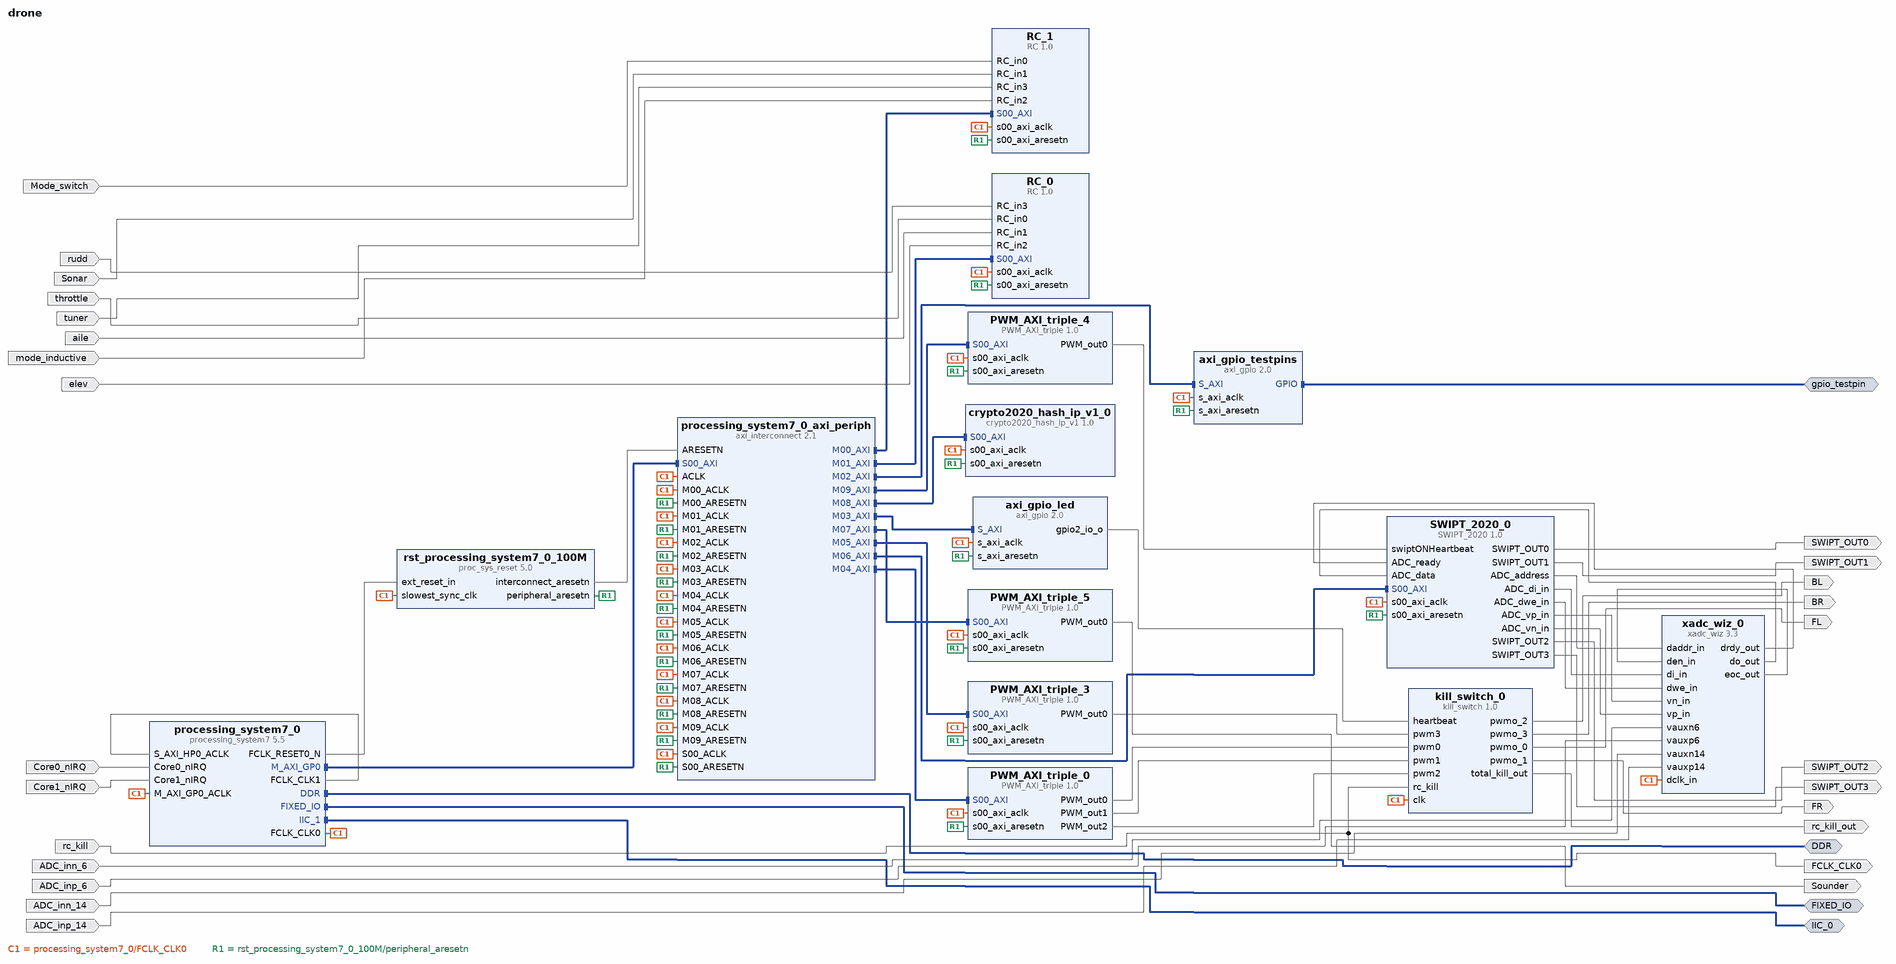
[diagram p0: block diagram of the top level]
# Vivado block design drone, xc7z010clg400-1, Vivado 2020.1
create_bd_design drone

create_bd_intf_port -mode Master -vlnv xilinx.com:interface:ddrx_rtl:1.0 DDR
create_bd_intf_port -mode Master -vlnv xilinx.com:display_processing_system7:fixedio_rtl:1.0 FIXED_IO
create_bd_intf_port -mode Master -vlnv xilinx.com:interface:iic_rtl:1.0 IIC_0
create_bd_intf_port -mode Master -vlnv xilinx.com:interface:gpio_rtl:1.0 gpio_testpin
create_bd_port -dir I rudd
create_bd_port -dir I rc_kill
create_bd_port -dir O -type clk FCLK_CLK0
create_bd_port -dir O rc_kill_out
create_bd_port -dir O FL
create_bd_port -dir O FR
create_bd_port -dir O BL
create_bd_port -dir O BR
create_bd_port -dir I -type intr Core0_nIRQ
create_bd_port -dir I -type intr Core1_nIRQ
create_bd_port -dir I throttle
create_bd_port -dir I aile
create_bd_port -dir I elev
create_bd_port -dir I Mode_switch
create_bd_port -dir I Sonar
create_bd_port -dir O Sounder
create_bd_port -dir I tuner
create_bd_port -dir I mode_inductive
create_bd_port -dir O -type data SWIPT_OUT0
create_bd_port -dir O -type data SWIPT_OUT1
create_bd_port -dir O -type data SWIPT_OUT2
create_bd_port -dir O -type data SWIPT_OUT3
create_bd_port -dir I ADC_inn_6
create_bd_port -dir I ADC_inp_6
create_bd_port -dir I ADC_inn_14
create_bd_port -dir I ADC_inp_14

create_bd_cell -type ip -vlnv xilinx.com:ip:processing_system7:5.5 processing_system7_0
set_property -dict [list \
  CONFIG.PCW_APU_PERIPHERAL_FREQMHZ 650 \
  CONFIG.PCW_CORE0_IRQ_INTR 1 \
  CONFIG.PCW_CORE1_IRQ_INTR 1 \
  CONFIG.PCW_CRYSTAL_PERIPHERAL_FREQMHZ 50.000000 \
  CONFIG.PCW_ENET0_ENET0_IO {MIO 16 .. 27} \
  CONFIG.PCW_ENET0_GRP_MDIO_ENABLE 1 \
  CONFIG.PCW_ENET0_GRP_MDIO_IO EMIO \
  CONFIG.PCW_ENET0_PERIPHERAL_ENABLE 1 \
  CONFIG.PCW_ENET0_RESET_ENABLE 0 \
  CONFIG.PCW_ENET_RESET_ENABLE 1 \
  CONFIG.PCW_ENET_RESET_SELECT {Share reset pin} \
  CONFIG.PCW_EN_CLK1_PORT 1 \
  CONFIG.PCW_EN_CLK2_PORT 1 \
  CONFIG.PCW_EN_CLK3_PORT 1 \
  CONFIG.PCW_EN_RST3_PORT 1 \
  CONFIG.PCW_FCLK_CLK1_BUF TRUE \
  CONFIG.PCW_FCLK_CLK2_BUF TRUE \
  CONFIG.PCW_FCLK_CLK3_BUF TRUE \
  CONFIG.PCW_FPGA0_PERIPHERAL_FREQMHZ 100 \
  CONFIG.PCW_FPGA1_PERIPHERAL_FREQMHZ 140 \
  CONFIG.PCW_FPGA2_PERIPHERAL_FREQMHZ 200 \
  CONFIG.PCW_FPGA3_PERIPHERAL_FREQMHZ 75 \
  CONFIG.PCW_FPGA_FCLK1_ENABLE 1 \
  CONFIG.PCW_FPGA_FCLK2_ENABLE 1 \
  CONFIG.PCW_FPGA_FCLK3_ENABLE 1 \
  CONFIG.PCW_GPIO_MIO_GPIO_ENABLE 1 \
  CONFIG.PCW_GPIO_MIO_GPIO_IO MIO \
  CONFIG.PCW_I2C0_GRP_INT_ENABLE 0 \
  CONFIG.PCW_I2C0_I2C0_IO {MIO 14 .. 15} \
  CONFIG.PCW_I2C0_PERIPHERAL_ENABLE 1 \
  CONFIG.PCW_I2C1_I2C1_IO EMIO \
  CONFIG.PCW_I2C1_PERIPHERAL_ENABLE 1 \
  CONFIG.PCW_I2C_PERIPHERAL_FREQMHZ 108.333336 \
  CONFIG.PCW_I2C_RESET_ENABLE 1 \
  CONFIG.PCW_I2C_RESET_SELECT {Share reset pin} \
  CONFIG.PCW_IRQ_F2P_INTR 1 \
  CONFIG.PCW_PRESET_BANK1_VOLTAGE {LVCMOS 1.8V} \
  CONFIG.PCW_QSPI_GRP_FBCLK_ENABLE 1 \
  CONFIG.PCW_QSPI_GRP_FBCLK_IO {MIO 8} \
  CONFIG.PCW_QSPI_GRP_SINGLE_SS_ENABLE 1 \
  CONFIG.PCW_QSPI_GRP_SINGLE_SS_IO {MIO 1 .. 6} \
  CONFIG.PCW_QSPI_PERIPHERAL_ENABLE 1 \
  CONFIG.PCW_QSPI_QSPI_IO {MIO 1 .. 6} \
  CONFIG.PCW_SD0_GRP_CD_ENABLE 1 \
  CONFIG.PCW_SD0_GRP_CD_IO {MIO 47} \
  CONFIG.PCW_SD0_GRP_WP_ENABLE 1 \
  CONFIG.PCW_SD0_GRP_WP_IO EMIO \
  CONFIG.PCW_SD0_PERIPHERAL_ENABLE 1 \
  CONFIG.PCW_SD0_SD0_IO {MIO 40 .. 45} \
  CONFIG.PCW_SDIO_PERIPHERAL_FREQMHZ 50 \
  CONFIG.PCW_SINGLE_QSPI_DATA_MODE x4 \
  CONFIG.PCW_TTC0_PERIPHERAL_ENABLE 1 \
  CONFIG.PCW_TTC0_TTC0_IO EMIO \
  CONFIG.PCW_UART1_PERIPHERAL_ENABLE 1 \
  CONFIG.PCW_UART1_UART1_IO {MIO 48 .. 49} \
  CONFIG.PCW_UART_PERIPHERAL_FREQMHZ 100 \
  CONFIG.PCW_UIPARAM_DDR_FREQ_MHZ 525 \
  CONFIG.PCW_UIPARAM_DDR_PARTNO {MT41K128M16 JT-125} \
  CONFIG.PCW_USB0_PERIPHERAL_ENABLE 1 \
  CONFIG.PCW_USB0_RESET_ENABLE 1 \
  CONFIG.PCW_USB0_RESET_IO {MIO 46} \
  CONFIG.PCW_USB0_USB0_IO {MIO 28 .. 39} \
  CONFIG.PCW_USB_RESET_ENABLE 1 \
  CONFIG.PCW_USB_RESET_SELECT {Share reset pin} \
  CONFIG.PCW_USE_FABRIC_INTERRUPT 1 \
  CONFIG.PCW_USE_S_AXI_HP0 1 \
  CONFIG.preset Default \
] [get_bd_cells processing_system7_0]
# 225 more settings of processing_system7_0 are not shown: defaults, MIO pin electricals, DDR timing, and values the tool derives
create_bd_cell -type ip -vlnv kuleuven.be:user:RC:1.0 RC_1
set_property -dict {CONFIG.C_S00_AXI_BASEADDR 0x43c00000 CONFIG.C_S00_AXI_HIGHADDR 0x43c0ffff} [get_bd_cells RC_1]
create_bd_cell -type ip -vlnv kuleuven.be:user:RC:1.0 RC_0
set_property -dict {CONFIG.C_S00_AXI_BASEADDR 0x43c10000 CONFIG.C_S00_AXI_HIGHADDR 0x43c1ffff} [get_bd_cells RC_0]
create_bd_cell -type ip -vlnv xilinx.com:ip:axi_gpio:2.0 axi_gpio_testpins
set_property -dict [list \
  CONFIG.C_ALL_OUTPUTS 1 \
  CONFIG.C_GPIO_WIDTH 1 \
  CONFIG.GPIO_BOARD_INTERFACE Custom \
  CONFIG.USE_BOARD_FLOW true \
] [get_bd_cells axi_gpio_testpins]
create_bd_cell -type ip -vlnv xilinx.com:ip:axi_gpio:2.0 axi_gpio_led
set_property -dict [list \
  CONFIG.C_ALL_OUTPUTS_2 1 \
  CONFIG.C_DOUT_DEFAULT 0x9FD5A10C \
  CONFIG.C_GPIO2_WIDTH 1 \
  CONFIG.C_IS_DUAL 1 \
  CONFIG.GPIO_BOARD_INTERFACE leds_4bits \
  CONFIG.USE_BOARD_FLOW true \
] [get_bd_cells axi_gpio_led]
create_bd_cell -type ip -vlnv kuleuven.be:user:kill_switch:1.0 kill_switch_0
create_bd_cell -type ip -vlnv kuleuven.be:user:PWM_AXI_triple:1.0 PWM_AXI_triple_0
set_property -dict {CONFIG.C_S00_AXI_BASEADDR 0x43C30000 CONFIG.C_S00_AXI_HIGHADDR 0x43C3FFFF} [get_bd_cells PWM_AXI_triple_0]
create_bd_cell -type ip -vlnv kuleuven.be:user:PWM_AXI_triple:1.0 PWM_AXI_triple_3
set_property -dict {CONFIG.C_S00_AXI_BASEADDR 0x43C40000 CONFIG.C_S00_AXI_HIGHADDR 0x43C4FFFF} [get_bd_cells PWM_AXI_triple_3]
create_bd_cell -type ip -vlnv kuleuven.be:user:PWM_AXI_triple:1.0 PWM_AXI_triple_5
set_property -dict {CONFIG.C_S00_AXI_BASEADDR 0x43C40000 CONFIG.C_S00_AXI_HIGHADDR 0x43C4FFFF} [get_bd_cells PWM_AXI_triple_5]
create_bd_cell -type ip -vlnv xilinx.com:ip:proc_sys_reset:5.0 rst_processing_system7_0_100M
create_bd_cell -type ip -vlnv xilinx.com:ip:axi_interconnect:2.1 processing_system7_0_axi_periph
set_property -dict {CONFIG.NUM_MI 10} [get_bd_cells processing_system7_0_axi_periph]
create_bd_cell -type ip -vlnv xilinx.com:ip:xadc_wiz:3.3 xadc_wiz_0
set_property -dict [list \
  CONFIG.ADC_CONVERSION_RATE 1000 \
  CONFIG.AVERAGE_ENABLE_TEMPERATURE false \
  CONFIG.AVERAGE_ENABLE_VAUXP14_VAUXN14 false \
  CONFIG.AVERAGE_ENABLE_VAUXP6_VAUXN6 false \
  CONFIG.BIPOLAR_VAUXP14_VAUXN14 true \
  CONFIG.CHANNEL_ENABLE_TEMPERATURE false \
  CONFIG.CHANNEL_ENABLE_VAUXP14_VAUXN14 true \
  CONFIG.CHANNEL_ENABLE_VAUXP6_VAUXN6 true \
  CONFIG.CHANNEL_ENABLE_VP_VN false \
  CONFIG.ENABLE_RESET false \
  CONFIG.ENABLE_VCCDDRO_ALARM false \
  CONFIG.ENABLE_VCCPAUX_ALARM false \
  CONFIG.ENABLE_VCCPINT_ALARM false \
  CONFIG.EXTERNAL_MUX_CHANNEL VP_VN \
  CONFIG.INTERFACE_SELECTION ENABLE_DRP \
  CONFIG.OT_ALARM false \
  CONFIG.SEQUENCER_MODE Continuous \
  CONFIG.SINGLE_CHANNEL_SELECTION TEMPERATURE \
  CONFIG.USER_TEMP_ALARM false \
  CONFIG.VCCAUX_ALARM false \
  CONFIG.VCCINT_ALARM false \
  CONFIG.XADC_STARUP_SELECTION channel_sequencer \
] [get_bd_cells xadc_wiz_0]
create_bd_cell -type ip -vlnv kuleuven.be:user:PWM_AXI_triple:1.0 PWM_AXI_triple_4
create_bd_cell -type ip -vlnv user.org:user:crypto2020_hash_ip_v1:1.0 crypto2020_hash_ip_v1_0
create_bd_cell -type ip -vlnv user.org:user:SWIPT_2020:1.0 SWIPT_2020_0

# ---- connections ----

connect_bd_intf_net [get_bd_intf_pins processing_system7_0_axi_periph/M08_AXI] [get_bd_intf_pins crypto2020_hash_ip_v1_0/S00_AXI]
connect_bd_intf_net [get_bd_intf_pins processing_system7_0_axi_periph/M09_AXI] [get_bd_intf_pins PWM_AXI_triple_4/S00_AXI]
connect_bd_intf_net [get_bd_intf_pins processing_system7_0_axi_periph/M00_AXI] [get_bd_intf_pins RC_1/S00_AXI]
connect_bd_intf_net [get_bd_intf_pins processing_system7_0_axi_periph/M07_AXI] [get_bd_intf_pins PWM_AXI_triple_5/S00_AXI]
connect_bd_intf_net [get_bd_intf_ports DDR] [get_bd_intf_pins processing_system7_0/DDR]
connect_bd_intf_net [get_bd_intf_pins processing_system7_0_axi_periph/M03_AXI] [get_bd_intf_pins axi_gpio_led/S_AXI]
connect_bd_intf_net [get_bd_intf_pins processing_system7_0/M_AXI_GP0] [get_bd_intf_pins processing_system7_0_axi_periph/S00_AXI]
connect_bd_intf_net [get_bd_intf_ports gpio_testpin] [get_bd_intf_pins axi_gpio_testpins/GPIO]
connect_bd_intf_net [get_bd_intf_pins processing_system7_0_axi_periph/M02_AXI] [get_bd_intf_pins axi_gpio_testpins/S_AXI]
connect_bd_intf_net [get_bd_intf_ports FIXED_IO] [get_bd_intf_pins processing_system7_0/FIXED_IO]
connect_bd_intf_net [get_bd_intf_ports IIC_0] [get_bd_intf_pins processing_system7_0/IIC_1]
connect_bd_intf_net [get_bd_intf_pins processing_system7_0_axi_periph/M05_AXI] [get_bd_intf_pins PWM_AXI_triple_3/S00_AXI]
connect_bd_intf_net [get_bd_intf_pins processing_system7_0_axi_periph/M01_AXI] [get_bd_intf_pins RC_0/S00_AXI]
connect_bd_intf_net [get_bd_intf_pins processing_system7_0_axi_periph/M06_AXI] [get_bd_intf_pins SWIPT_2020_0/S00_AXI]
connect_bd_intf_net [get_bd_intf_pins processing_system7_0_axi_periph/M04_AXI] [get_bd_intf_pins PWM_AXI_triple_0/S00_AXI]
connect_bd_net [get_bd_pins processing_system7_0/FCLK_CLK0] \
  [get_bd_pins processing_system7_0/M_AXI_GP0_ACLK] [get_bd_pins RC_1/s00_axi_aclk] [get_bd_pins RC_0/s00_axi_aclk] \
  [get_bd_pins axi_gpio_testpins/s_axi_aclk] [get_bd_pins axi_gpio_led/s_axi_aclk] [get_bd_pins kill_switch_0/clk] \
  [get_bd_pins PWM_AXI_triple_0/s00_axi_aclk] [get_bd_pins PWM_AXI_triple_3/s00_axi_aclk] \
  [get_bd_pins PWM_AXI_triple_5/s00_axi_aclk] [get_bd_pins rst_processing_system7_0_100M/slowest_sync_clk] \
  [get_bd_pins xadc_wiz_0/dclk_in] [get_bd_pins PWM_AXI_triple_4/s00_axi_aclk] \
  [get_bd_pins processing_system7_0_axi_periph/S00_ACLK] [get_bd_pins processing_system7_0_axi_periph/ACLK] \
  [get_bd_pins processing_system7_0_axi_periph/M00_ACLK] [get_bd_pins processing_system7_0_axi_periph/M01_ACLK] \
  [get_bd_pins processing_system7_0_axi_periph/M02_ACLK] [get_bd_pins processing_system7_0_axi_periph/M03_ACLK] \
  [get_bd_pins processing_system7_0_axi_periph/M04_ACLK] [get_bd_pins processing_system7_0_axi_periph/M05_ACLK] \
  [get_bd_pins processing_system7_0_axi_periph/M06_ACLK] [get_bd_pins processing_system7_0_axi_periph/M07_ACLK] \
  [get_bd_pins processing_system7_0_axi_periph/M08_ACLK] [get_bd_pins processing_system7_0_axi_periph/M09_ACLK] \
  [get_bd_pins crypto2020_hash_ip_v1_0/s00_axi_aclk] [get_bd_pins SWIPT_2020_0/s00_axi_aclk]
connect_bd_net [get_bd_pins rst_processing_system7_0_100M/peripheral_aresetn] \
  [get_bd_pins RC_1/s00_axi_aresetn] [get_bd_pins RC_0/s00_axi_aresetn] [get_bd_pins axi_gpio_testpins/s_axi_aresetn] \
  [get_bd_pins axi_gpio_led/s_axi_aresetn] [get_bd_pins PWM_AXI_triple_0/s00_axi_aresetn] \
  [get_bd_pins PWM_AXI_triple_3/s00_axi_aresetn] [get_bd_pins PWM_AXI_triple_5/s00_axi_aresetn] \
  [get_bd_pins PWM_AXI_triple_4/s00_axi_aresetn] [get_bd_pins processing_system7_0_axi_periph/S00_ARESETN] \
  [get_bd_pins processing_system7_0_axi_periph/M00_ARESETN] [get_bd_pins processing_system7_0_axi_periph/M01_ARESETN] \
  [get_bd_pins processing_system7_0_axi_periph/M02_ARESETN] [get_bd_pins processing_system7_0_axi_periph/M03_ARESETN] \
  [get_bd_pins processing_system7_0_axi_periph/M04_ARESETN] [get_bd_pins processing_system7_0_axi_periph/M05_ARESETN] \
  [get_bd_pins processing_system7_0_axi_periph/M06_ARESETN] [get_bd_pins processing_system7_0_axi_periph/M07_ARESETN] \
  [get_bd_pins processing_system7_0_axi_periph/M08_ARESETN] [get_bd_pins processing_system7_0_axi_periph/M09_ARESETN] \
  [get_bd_pins crypto2020_hash_ip_v1_0/s00_axi_aresetn] [get_bd_pins SWIPT_2020_0/s00_axi_aresetn]
connect_bd_net -net RC_in_3_1 [get_bd_ports rudd] [get_bd_pins RC_0/RC_in3]
connect_bd_net [get_bd_ports rc_kill] [get_bd_ports FCLK_CLK0] [get_bd_pins kill_switch_0/rc_kill]
connect_bd_net [get_bd_pins axi_gpio_led/gpio2_io_o] [get_bd_pins kill_switch_0/heartbeat]
connect_bd_net -net kill_switch_0_rc_kill_out [get_bd_pins kill_switch_0/total_kill_out] [get_bd_ports rc_kill_out]
connect_bd_net [get_bd_pins kill_switch_0/pwmo_0] [get_bd_ports FL]
connect_bd_net [get_bd_pins kill_switch_0/pwmo_1] [get_bd_ports FR]
connect_bd_net [get_bd_pins kill_switch_0/pwmo_2] [get_bd_ports BL]
connect_bd_net [get_bd_pins kill_switch_0/pwmo_3] [get_bd_ports BR]
connect_bd_net [get_bd_ports Core0_nIRQ] [get_bd_pins processing_system7_0/Core0_nIRQ]
connect_bd_net [get_bd_ports Core1_nIRQ] [get_bd_pins processing_system7_0/Core1_nIRQ]
connect_bd_net [get_bd_pins PWM_AXI_triple_0/PWM_out0] [get_bd_pins kill_switch_0/pwm0]
connect_bd_net [get_bd_pins PWM_AXI_triple_0/PWM_out1] [get_bd_pins kill_switch_0/pwm1]
connect_bd_net [get_bd_pins PWM_AXI_triple_0/PWM_out2] [get_bd_pins kill_switch_0/pwm2]
connect_bd_net [get_bd_pins PWM_AXI_triple_3/PWM_out0] [get_bd_pins kill_switch_0/pwm3]
connect_bd_net [get_bd_ports throttle] [get_bd_pins RC_0/RC_in0]
connect_bd_net [get_bd_ports aile] [get_bd_pins RC_0/RC_in1]
connect_bd_net [get_bd_ports elev] [get_bd_pins RC_0/RC_in2]
connect_bd_net [get_bd_ports Mode_switch] [get_bd_pins RC_1/RC_in0]
connect_bd_net [get_bd_ports Sonar] [get_bd_pins RC_1/RC_in1]
connect_bd_net [get_bd_pins processing_system7_0/FCLK_CLK1] [get_bd_pins processing_system7_0/S_AXI_HP0_ACLK]
connect_bd_net [get_bd_pins PWM_AXI_triple_5/PWM_out0] [get_bd_ports Sounder]
connect_bd_net [get_bd_ports tuner] [get_bd_pins RC_1/RC_in3]
connect_bd_net [get_bd_ports mode_inductive] [get_bd_pins RC_1/RC_in2]
connect_bd_net [get_bd_pins processing_system7_0/FCLK_RESET0_N] [get_bd_pins rst_processing_system7_0_100M/ext_reset_in]
connect_bd_net [get_bd_pins rst_processing_system7_0_100M/interconnect_aresetn] [get_bd_pins processing_system7_0_axi_periph/ARESETN]
connect_bd_net [get_bd_pins SWIPT_2020_0/SWIPT_OUT0] [get_bd_ports SWIPT_OUT0]
connect_bd_net [get_bd_pins SWIPT_2020_0/SWIPT_OUT1] [get_bd_ports SWIPT_OUT1]
connect_bd_net [get_bd_pins SWIPT_2020_0/SWIPT_OUT2] [get_bd_ports SWIPT_OUT2]
connect_bd_net [get_bd_pins SWIPT_2020_0/SWIPT_OUT3] [get_bd_ports SWIPT_OUT3]
connect_bd_net -net ADC_inn_6_1 [get_bd_ports ADC_inn_6] [get_bd_pins xadc_wiz_0/vauxn6]
connect_bd_net -net ADC_inp_6_1 [get_bd_ports ADC_inp_6] [get_bd_pins xadc_wiz_0/vauxp6]
connect_bd_net -net ADC_inn_14_1 [get_bd_ports ADC_inn_14] [get_bd_pins xadc_wiz_0/vauxn14]
connect_bd_net -net ADC_inp_14_1 [get_bd_ports ADC_inp_14] [get_bd_pins xadc_wiz_0/vauxp14]
connect_bd_net [get_bd_pins xadc_wiz_0/eoc_out] [get_bd_pins xadc_wiz_0/den_in]
connect_bd_net [get_bd_pins SWIPT_2020_0/ADC_address] [get_bd_pins xadc_wiz_0/daddr_in]
connect_bd_net [get_bd_pins SWIPT_2020_0/ADC_di_in] [get_bd_pins xadc_wiz_0/di_in]
connect_bd_net [get_bd_pins SWIPT_2020_0/ADC_dwe_in] [get_bd_pins xadc_wiz_0/dwe_in]
connect_bd_net [get_bd_pins SWIPT_2020_0/ADC_vp_in] [get_bd_pins xadc_wiz_0/vn_in]
connect_bd_net [get_bd_pins SWIPT_2020_0/ADC_vn_in] [get_bd_pins xadc_wiz_0/vp_in]
connect_bd_net [get_bd_pins xadc_wiz_0/drdy_out] [get_bd_pins SWIPT_2020_0/ADC_ready]
connect_bd_net [get_bd_pins xadc_wiz_0/do_out] [get_bd_pins SWIPT_2020_0/ADC_data]
connect_bd_net [get_bd_pins PWM_AXI_triple_4/PWM_out0] [get_bd_pins SWIPT_2020_0/swiptONHeartbeat]

# ---- address map ----
assign_bd_address -offset 0x41200000 -range 64K -target_address_space [get_bd_addr_spaces processing_system7_0/Data] [get_bd_addr_segs axi_gpio_testpins/S_AXI/Reg]
assign_bd_address -offset 0x41210000 -range 64K -target_address_space [get_bd_addr_spaces processing_system7_0/Data] [get_bd_addr_segs axi_gpio_led/S_AXI/Reg]
assign_bd_address -offset 0x43C00000 -range 64K -target_address_space [get_bd_addr_spaces processing_system7_0/Data] [get_bd_addr_segs RC_1/S00_AXI/S00_AXI_reg]
assign_bd_address -offset 0x43C10000 -range 64K -target_address_space [get_bd_addr_spaces processing_system7_0/Data] [get_bd_addr_segs RC_0/S00_AXI/S00_AXI_reg]
assign_bd_address -offset 0x43C20000 -range 64K -target_address_space [get_bd_addr_spaces processing_system7_0/Data] [get_bd_addr_segs PWM_AXI_triple_0/S00_AXI/S00_AXI_reg]
assign_bd_address -offset 0x43C30000 -range 64K -target_address_space [get_bd_addr_spaces processing_system7_0/Data] [get_bd_addr_segs PWM_AXI_triple_3/S00_AXI/S00_AXI_reg]
assign_bd_address -offset 0x43C40000 -range 64K -target_address_space [get_bd_addr_spaces processing_system7_0/Data] [get_bd_addr_segs PWM_AXI_triple_4/S00_AXI/S00_AXI_reg]
assign_bd_address -offset 0x43C50000 -range 64K -target_address_space [get_bd_addr_spaces processing_system7_0/Data] [get_bd_addr_segs PWM_AXI_triple_5/S00_AXI/S00_AXI_reg]
assign_bd_address -offset 0x43C60000 -range 4K -target_address_space [get_bd_addr_spaces processing_system7_0/Data] [get_bd_addr_segs SWIPT_2020_0/S00_AXI/S00_AXI_reg]
assign_bd_address -offset 0x7AA00000 -range 64K -target_address_space [get_bd_addr_spaces processing_system7_0/Data] [get_bd_addr_segs crypto2020_hash_ip_v1_0/S00_AXI/S00_AXI_mem]

validate_bd_design
save_bd_design
